# EAGLE schematic Sprinkler (EAGLE 9.6.2)
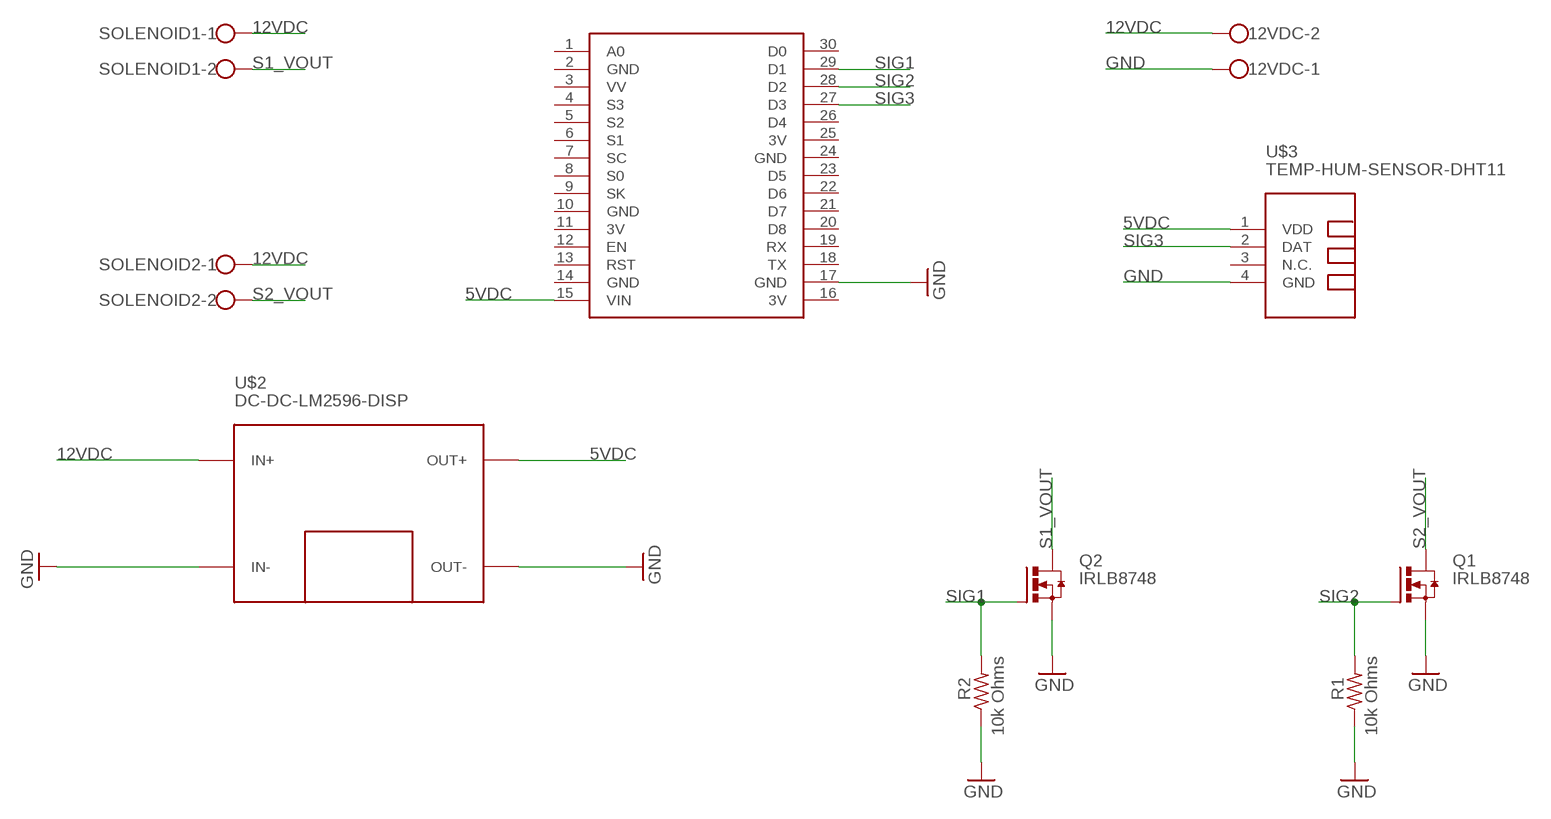
[diagram p0: schematic, sheet 1]

## Parts
12VDC  W237-102  [W237-102]
Q1  IRLB8748  IRF3704  [TO220AH]
Q2  IRLB8748  IRF3704  [TO220AH]
R1  10k Ohms  R-US_0204/7  [0204/7]
R2  10k Ohms  R-US_0204/7  [0204/7]
SOLENOID1  W237-102  [W237-102]
SOLENOID2  W237-102  [W237-102]
U$1  NODEMCU  [NODEMCU]
U$2  DC-DC-LM2596-DISP  [DC-DC-LM2596-DISP]
U$3  TEMP-HUM-SENSOR-DHT11  [TEMP-HUM-SENSOR-DHT11]

## Nets
5VDC: U$1.15(VIN) U$2.OUT+ U$3.1(VDD)
12VDC: 12VDC.2 SOLENOID1.1 SOLENOID2.1 U$2.IN+
GND: 12VDC.1 Q1.E(S) Q2.E(S) R1.1 R2.1 U$1.17(GND) U$2.IN- U$2.OUT- U$3.4(GND)
S1_VOUT: Q2.C(D) SOLENOID1.2
S2_VOUT: Q1.C(D) SOLENOID2.2
SIG1: Q2.B(G) R2.2 U$1.29(D1)
SIG2: Q1.B(G) R1.2 U$1.28(D2)
SIG3: U$1.27(D3) U$3.2(DAT)
Unconnected: U$1.1(A0) U$1.3(VV) U$1.4(S3) U$1.5(S2) U$1.6(S1) U$1.7(SC) U$1.8(S0) U$1.9(SK) U$1.12(EN) U$1.13(RST) U$1.18(TX) U$1.19(RX) U$1.20(D8) U$1.21(D7) U$1.22(D6) U$1.23(D5) U$1.26(D4) U$1.30(D0) U$3.3(N.C.)

## Power pins joined to a net without a drawn wire
3V: U$1.11(3V) U$1.16(3V) U$1.25(3V)
GND: U$1.2(GND) U$1.10(GND) U$1.14(GND) U$1.24(GND)

## Library data of the parts
12VDC SOLENOID1 SOLENOID2 = con-wago-500:W237-102: WAGO SCREW CLAMP; MPN: 237-102; OC_FARNELL: unknown; OC_NEWARK: 70K9898
Q1 Q2 = transistor-power:IRF3704: SMPS MOSFET HEXFET® Power MOSFET Source: http://www.irf.com/product-info/datasheets/data/irf3704.pdf
R1 R2 = rcl:R-US_: RESISTOR, American symbol; SPICEPREFIX: R
U$1 = nodemcu:NODEMCU
U$2 = diy-modules:DC-DC-LM2596-DISP: DC/DC Step-Down Regulator with Voltage Display based on LM2596-ADJ chip More details available here: http://www.instructables.com/id/The-Introduction-of-LM2596-Step-Down-Power-Module-/ LM2596 datasheet available here: http://www.ti.com/lit/ds/symlink/lm2596.pdf Click here to find device on ebay.com <http://www.ebay.com/sch/lm2596+led+voltmeter+40>
U$3 = diy-modules:TEMP-HUM-SENSOR-DHT11: DHT11 - digital humidity & temperature sensor DHT11 datasheet available here: https://akizukidenshi.com/download/ds/aosong/DHT11.pdf Click here to find device on ebay.com <http://www.ebay.com/sch/dht11+digital+sensor>